# Altium schematic sheet band_pass_filter.SchDoc
size A4
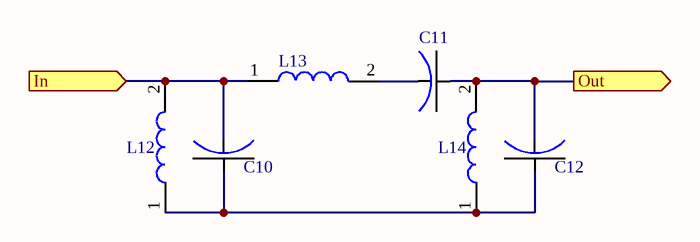
[diagram p0: band_pass_filter.SchDoc]

## Parts
C10  Cap  [C2225]  (value not drawn)
C11  Cap  [C1812]  (value not drawn)
C12  Cap  [C2225]  (value not drawn)
L12  L1008  [L1008]  (value not drawn)
L13  L1008  [L1008]  (value not drawn)
L14  L1008  [L1008]  (value not drawn)

## Ports
In (in), Out (out)

## Nets
In: C10.1 L12.2 L13.1 ; port In
Out: C11.2 C12.1 L14.2 ; port Out
NetC10_2: C10.2 C12.2 L12.1 L14.1
NetC11_1: C11.1 L13.2

## Library data of the parts
L12-L14 = L1008: Vishay IMC1008E2RJ7